# EAGLE design Grove-LED Socket Kit v1.3 (EAGLE 7.2.0)
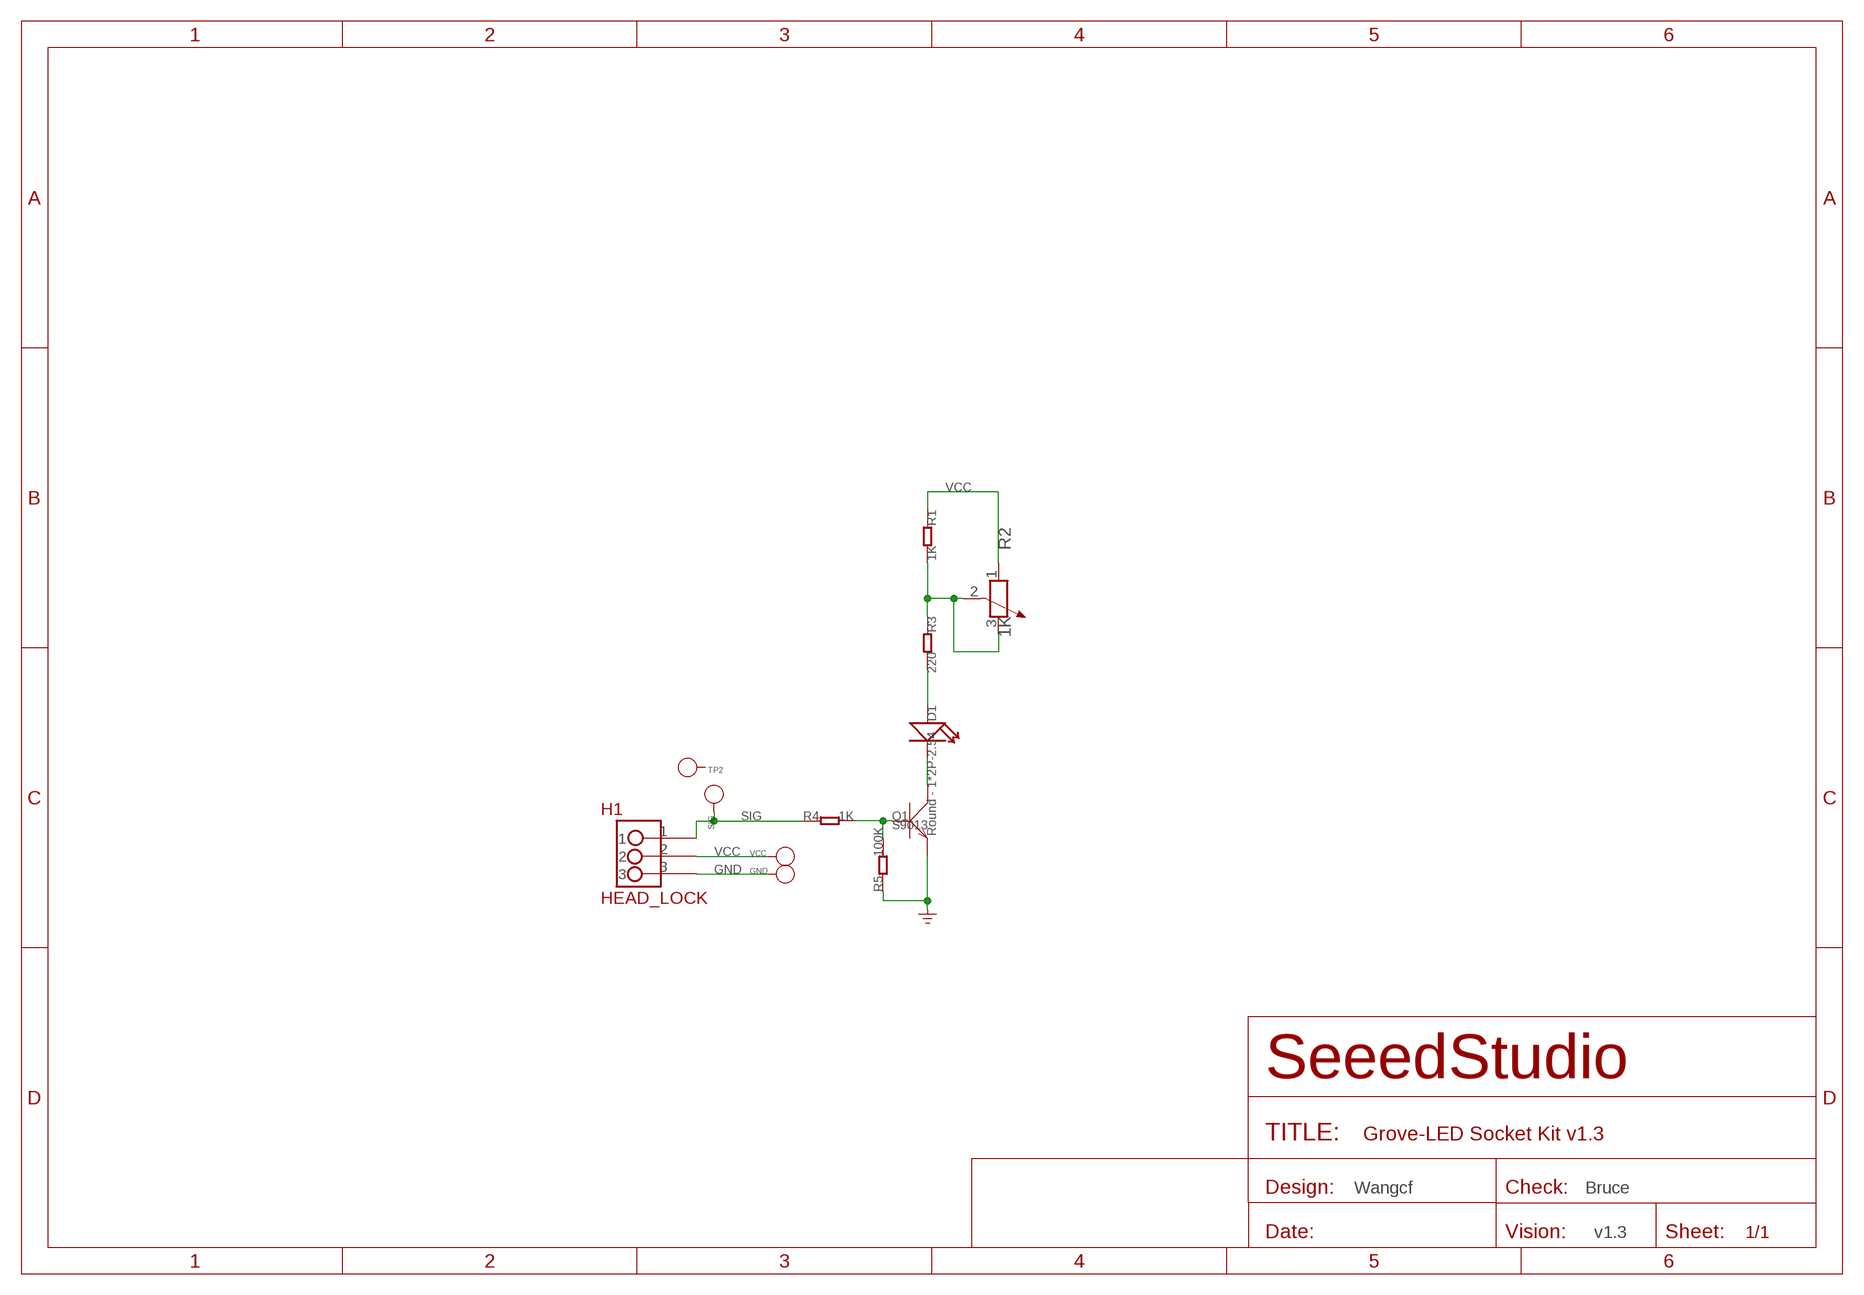
[diagram p0: schematic, sheet 1]

## Parts
D1  Round - 1*2P-2.54  LED-6MM  [LED-2P-2.54-6MM]
GND  PAD-TEST-POINT'4545'  [TP_4545]
H1  HEAD_LOCK  [HEAD_LOCK]
Q1  S9013  TRANSISTOR-NPN-SOT23  [SOT23]
R1  1K  005-R0603  [0603]
R2  1K  R-POTENTIOMETER'EVN-D8A-A03-B**'  [3P-SQUA-6.7X6.4]
R3  220  005-R0603  [0603]
R4  1K  005-R0603  [0603]
R5  100K  005-R0603  [0603]
SIG  PAD-TEST-POINT'4545'  [TP_4545]
TP2  PAD-TEST-POINT'4545'  [TP_4545]
VCC  PAD-TEST-POINT'4545'  [TP_4545]

## Nets
GND: GND.T H1.3 Q1.2(E) R5.1
N$1: R1.2 R2.2 R2.3 R3.1
N$2: D1.- Q1.3(C)
N$3: D1.+ R3.2
N$4: Q1.1(B) R4.2 R5.2
SIG: H1.1 R4.1 SIG.T
VCC: H1.2 R1.1 R2.1 VCC.T
Unconnected: TP2.T

## Notes on the sheet
- Wangcf | Bruce
- v1.3

## Library data of the parts
D1 = Discrete:LED*
GND SIG TP2 VCC = Discrete:PAD-TEST-POINT; PARTNO: DNP
H1 = HEAD_LOCK:HEAD_LOCK: 带锁的排座
Q1 = Discrete:TRANSISTOR-NPN*: NPN audion
R1 R3-R5 = Discrete:005-R*
R2 = Discrete:R-POTENTIOMETER*: Potentiometer

## Board
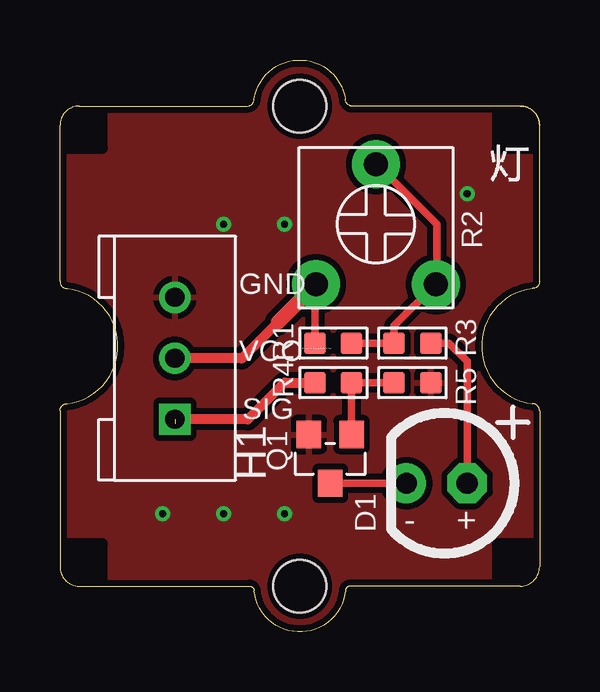
[diagram p1: board, top side]
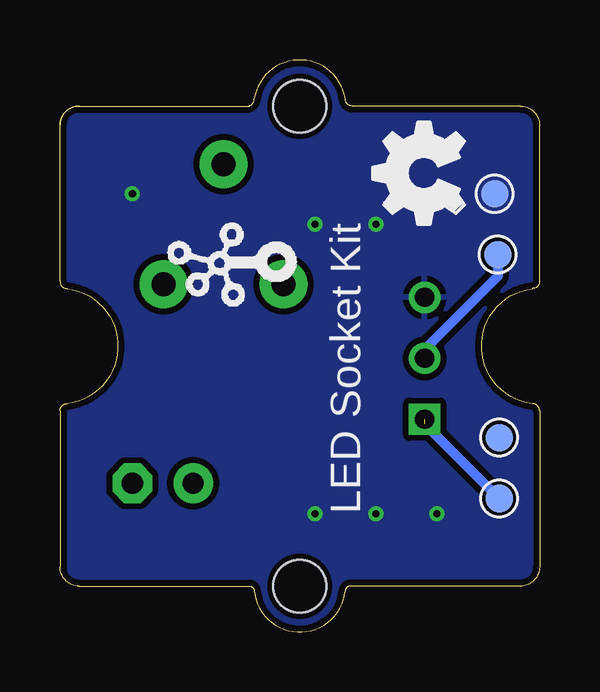
[diagram p2: board, bottom side, seen from below]

Size 20 x 23.83 mm. Coordinates in mm from the lower left corner, seen from the top.
Copper layers (1*16): Top 0.035mm / dielectric 1.5mm / Bottom 0.035mm
Design rules "SeeedStudio_rule_no_angle_090911 *": minimum track width 6mil, minimum drill 12mil, track to track 6mil, track to pad 6mil, pad to pad 6mil, via to via 6mil, smd to smd 0mil, copper to edge 10mil, drill to drill 10mil, minimum pad ring 10mil, minimum via ring 6mil, stop-mask expansion 2mil, vias tented up to drill 25mil, thermal gap 10mil

### Footprints (pad centres in the part's own frame; a part is rotated, then mirrored left to right if it is on the bottom)
LED-2P-2.54-6MM = drill 0.889 pad 1.651 octagon: + -1.27,0 | drill 0.889 pad 1.651: - 1.27,0
TP_4545 = smd 1.143 x 1.143: T 0,0
HEAD_LOCK = drill 0.8 square: 1 0,0 | drill 0.8: 2 2.54,0; 3 5.08,0
SOT23 = smd 1.016 x 1.143: 1 -0.889,-1.016; 2 0.889,-1.016; 3 0,1.016
0603 = smd 0.889 x 0.889: 1 -0.762,0; 2 0.762,0
3P-SQUA-6.7X6.4 = drill 1 pad 2: 1 -2.5,-2.5; 2 0,2.5; 3 2.5,-2.5
1U-DIM-W/-DRILL = hole 2.2: 0,-10; 0,10

### Placement (x,y rotation side)
D1  15.71,6.19 180 top
GND  1.87,18.26 0 bottom
H1  4.79,8.86 90 top
Q1  11.27,7.21 180 top
R1  11.4,12.04 0 top
R2  13.18,16.99 0 top
R3  14.7,12.04 0 top
R4  11.4,10.38 0 top
R5  14.7,10.38 180 top
SIG  1.68,5.56 0 bottom
TP2  1.68,8.1 0 bottom
U$2  [1U-DIM-W/-DRILL]  10,11.91 0 top
U$5  [TWIGLOGO_SMALL]  10,13.18 90 bottom
U$6  [OSHW_FILLX150_NOTEXT]  3.14,16.99 90 bottom
VCC  1.74,15.72 0 bottom

### Tracks (layer width: path | path; a pad name or v marks a point on that pad's centre or on a via)
GND  (via drill 0.3 pad 0.64)
  other vias: 6.83,16.99 16.98,18.26 9.37,16.99 4.29,4.92 9.37,4.92 6.83,4.92
  pour Top (isolate 0.254): -0.16,-0.16 20.16,-0.16 20.16,23.97 -0.16,23.97
  pour Bottom (isolate 0.254): -0.16,-0.16 20.16,-0.16 20.16,23.97 -0.16,23.97
N$1
  Top 0.305: R1.2 R3.1 13.94,12.75 R2.3 15.71,14.53 15.71,16.99 13.21,19.49 R2.2
N$2
  Top 0.305: Q1.3 D1.-
N$3
  Top 0.305: R3.2 16.22,12.04 16.98,11.27 D1.+ | D1.+
N$4
  Top 0.305: R5.2 R4.2 Q1.1
SIG  (1 unrouted)
  Top 0.406: R4.1 9.37,10.38 7.84,8.86 H1.1
  Bottom 0.406: 4.79,8.67 SIG.T
VCC
  Top 0.305: 10.63,14.45 R1.1
  Top 0.406: 9.1,12.91 7.59,11.4 H1.2
  Top 0.61: 9.1,12.91 10.63,14.45 R2.1
  Bottom 0.406: VCC.T 1.74,14.81 4.65,11.91 H1.2

### Text on the board
tPlace: GND | C:/Users/Xiangzi/Desktop/Ãû³Æ/LED.bmp | VCC | SIG
bPlace: LED Socket Kit